# Altium schematic sheet _Top Sheet.SchDoc
size B; Organization: Altium Limited; Address1: L3, 12a Rodborough Rd; Address2: Frenchs Forest; Address3: NSW; Address4: Australia 2086; SheetNumber: 1; SheetTotal: 1
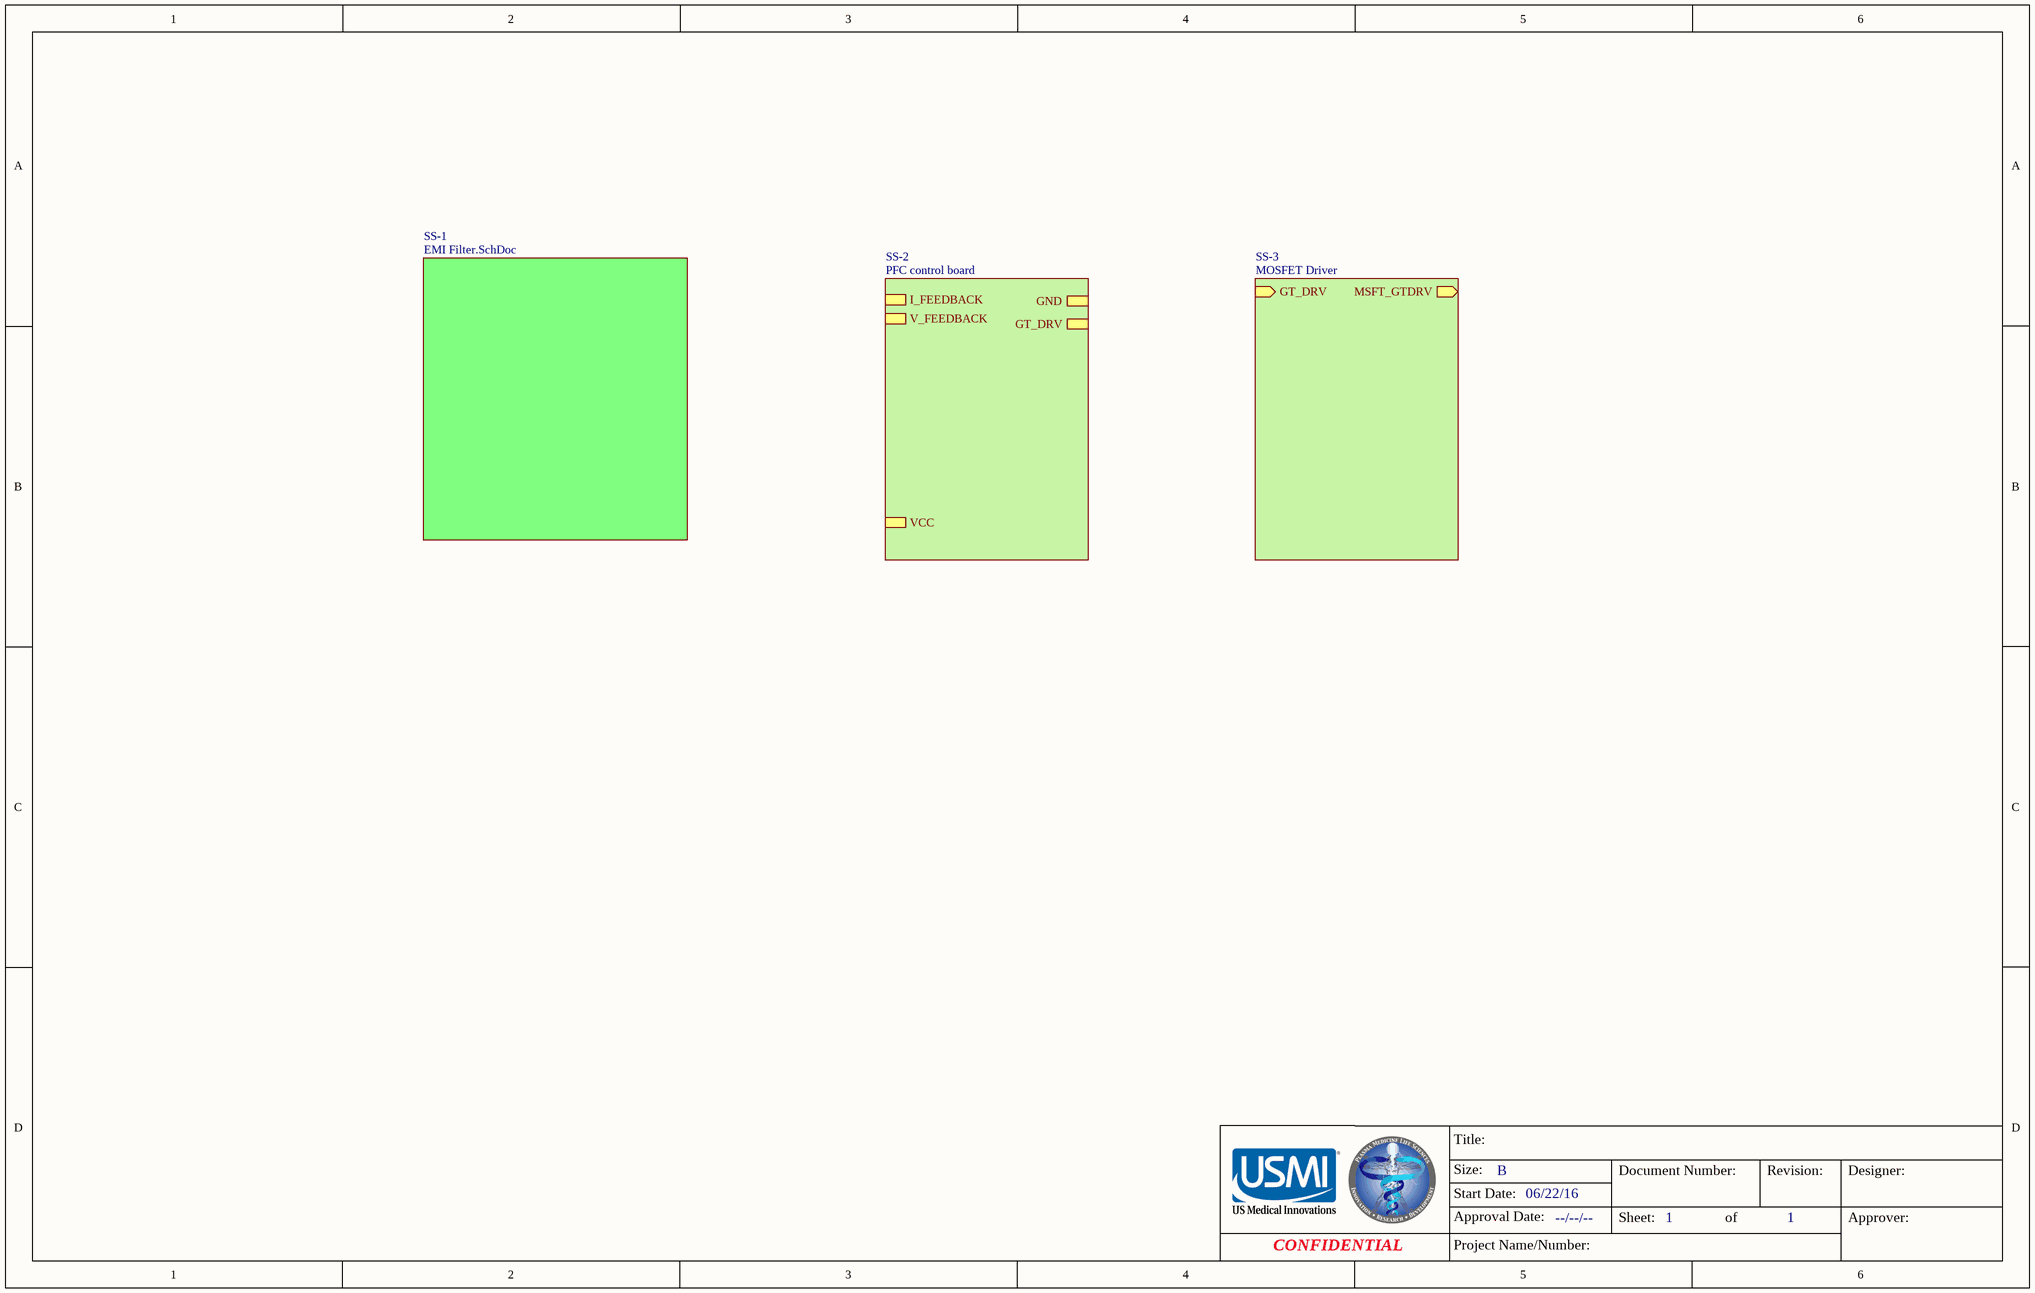
[diagram p0: _Top Sheet.SchDoc]

## Sub-sheets
SS-1 = EMI Filter.SchDoc: no entries
SS-2 = PFC control board: GND, GT_DRV, I_FEEDBACK, V_FEEDBACK, VCC
SS-3 = MOSFET Driver: MSFT_GTDRV (out), GT_DRV (in)

## Notes on the sheet
- Title:
- Size:
- B
- Document Number:
- Revision:
- Designer:
- Approval Date:
- Start Date:
- 06/22/16
- --/--/--
- Sheet:
- of
- Approver:
- CONFIDENTIAL
- Project Name/Number: